# EAGLE schematic E-P-204-R3.4 (EAGLE 7.7.0)
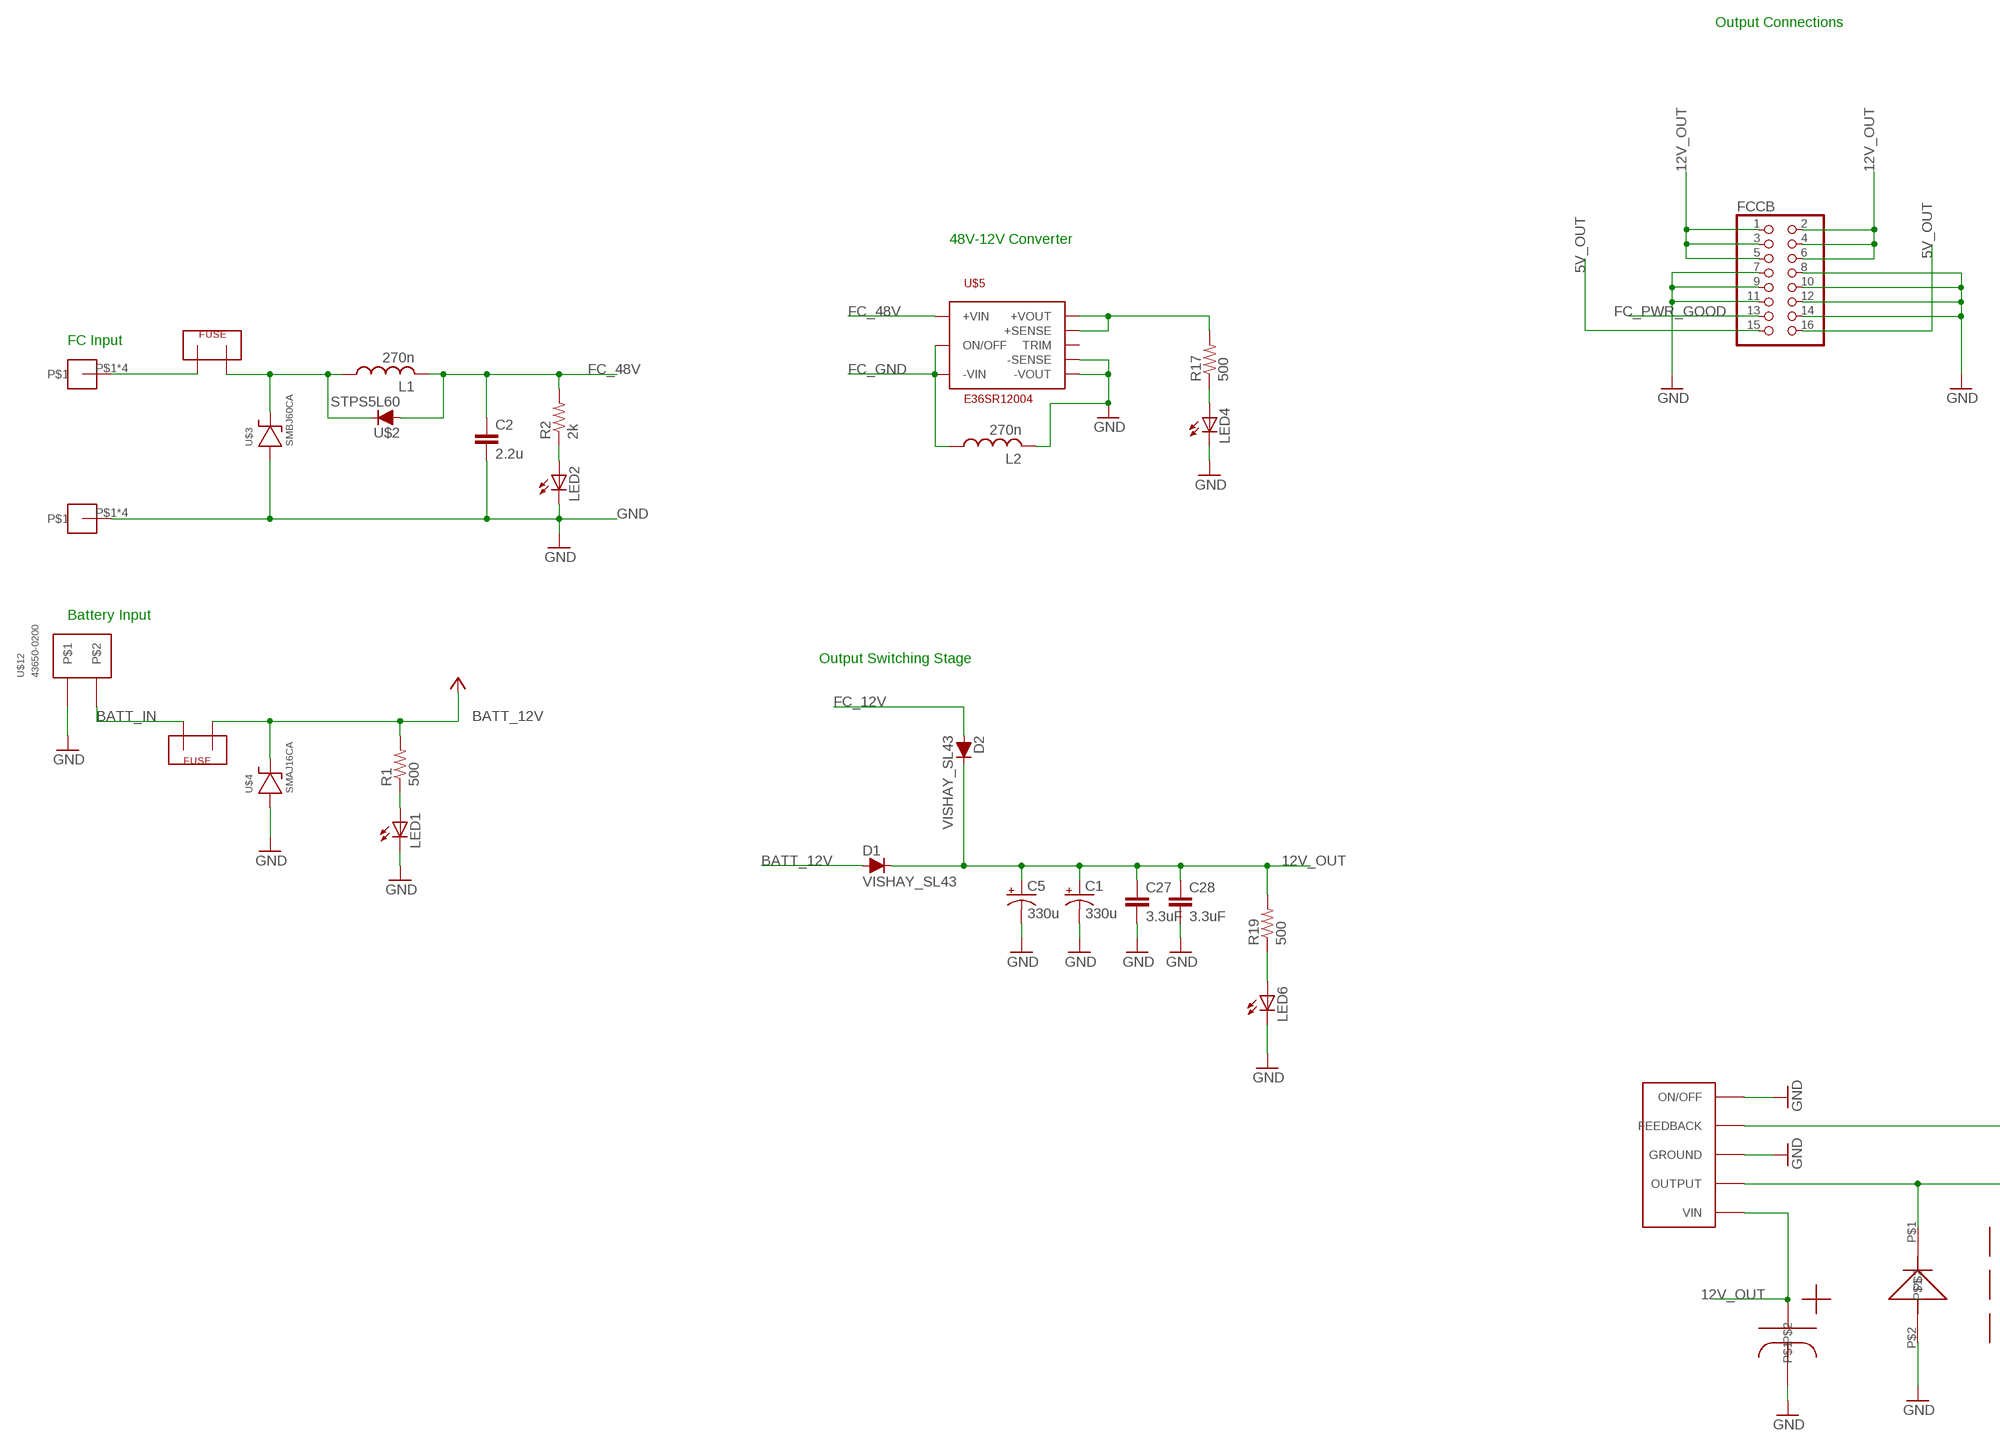
[diagram p0: schematic, sheet 1, part 1 of 2]
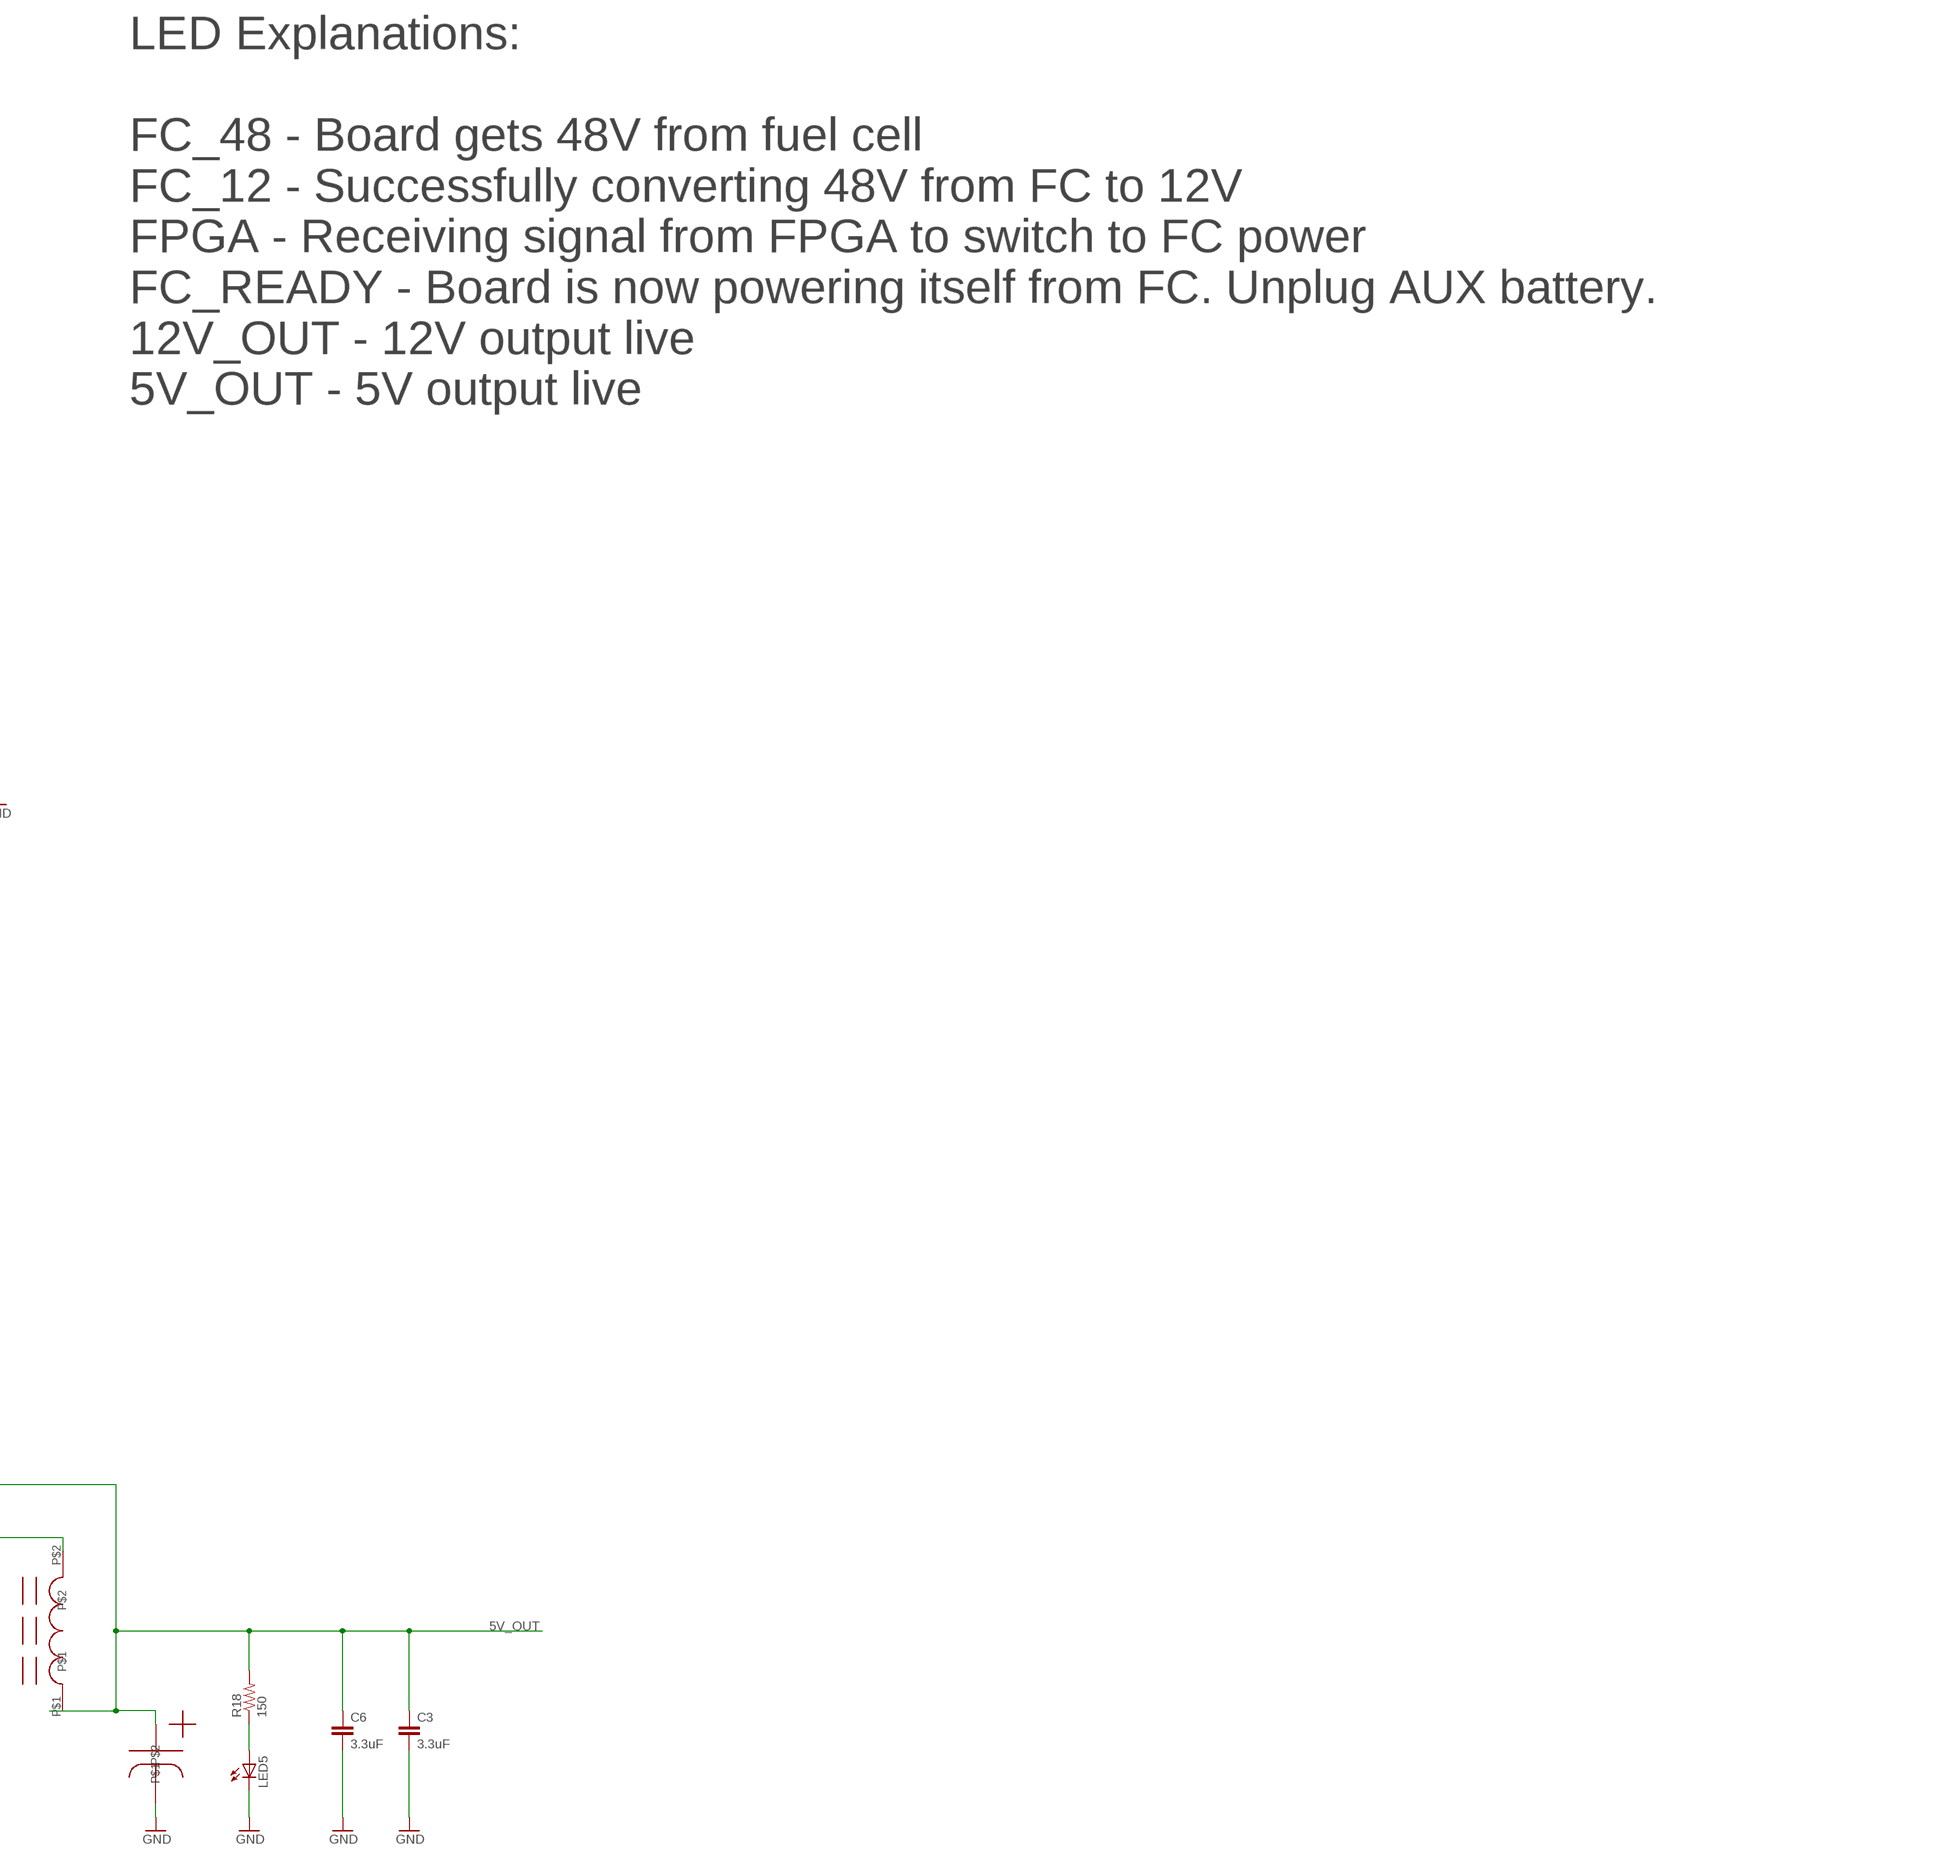
[diagram p1: schematic, sheet 1, part 2 of 2]

## Parts
C1  330u  CAP_POLE  [PANASONIC_E]
C2  2.2u  C-EUC1210  [C1210]
C3  3.3uF  C-EUC0805K  [C0805K]
C5  330u  CAP_POLE  [PANASONIC_E]
C6  3.3uF  C-EUC0805K  [C0805K]
C27  3.3uF  C-EUC0805K  [C0805K]
C28  3.3uF  C-EUC0805K  [C0805K]
D1  VISHAY_SL43  [DO-214AB_SMC]
D2  VISHAY_SL43  [DO-214AB_SMC]
FCCB  PINHD-2X8  [2X08]
L1  270n  L-USL3225P  [L3225P]
L2  270n  L-USL3225P  [L3225P]
LED1  LED1206  [LED-1206]
LED2  LED1206  [LED-1206]
LED4  LED1206  [LED-1206]
LED5  LED1206  [LED-1206]
LED6  LED1206  [LED-1206]
R1  500  R-US_M0805  [M0805]
R2  2k  R-US_M0805  [M0805]
R17  500  R-US_M0805  [M0805]
R18  150  R-US_M0805  [M0805]
R19  500  R-US_M0805  [M0805]
U$2  STPS5L60  [STM_SMC]
U$3  SMBJ60CA  [.277X.089]
U$4  SMAJ16CA  [.25X.07]
U$5  E36SR12004  [2.30X0.90X0.34]
U$6  SCREW-8191  [SCREW-8191]
U$7  FUSEMINI-BLADE  [MINI-BLADE-FUSE]
U$8  SCREW-8191  [SCREW-8191]
U$9  MBR360GOS  [MBR360GOS]
U$10  FUSEMINI-BLADE  [MINI-BLADE-FUSE]
U$12  43650-0200  [43650-0200]
U$14  LM2576  [D2PAK-5]
U$15  CAPESK107M025AC3AA  [ESK107M025AC3AA]
U$16  CAPESK108M025AH4EA  [ESK108M025AH4EA]
U$17  M1418-ND  [M1418-ND]

## Nets
5V_OUT: C3.1 C6.1 FCCB.15 FCCB.16 R18.2 U$14.4(FEEDBACK) U$16.P$1
12V_OUT: C1.+ C5.+ C27.1 C28.1 D1.C D2.C FCCB.1 FCCB.2 FCCB.3 FCCB.4 FCCB.5 FCCB.6 R19.2 U$14.1(VIN) U$15.P$1
BATT_12V: D1.A R1.2 U$4.CATHODE U$10.OUT ; supply symbol labelled +5V
BATT_IN: U$10.IN U$12.P$1
FC_12V: D2.A R17.2 U$5.P$7(+SENSE) U$5.P$8(+VOUT)
FC_48V: C2.1 L1.2 R2.2 U$2.A U$5.P$1(+VIN)
FC_FUSED: L1.1 U$2.C U$3.CATHODE U$7.IN
FC_GND: L2.1 U$5.P$2(ON/OFF) U$5.P$3(-VIN)
FC_IN: U$7.OUT U$8.P$1 U$8.P$2 U$8.P$3 U$8.P$4
FC_PWR_GOOD: FCCB.13
GND: C1.- C2.2 C3.2 C5.- C6.2 C27.2 C28.2 FCCB.7 FCCB.8 FCCB.9 FCCB.10 FCCB.11 FCCB.12 FCCB.14 L2.2 LED1.C LED2.C LED4.C LED5.C LED6.C U$3.ANODE U$4.ANODE U$5.P$4(-VOUT) U$5.P$5(-SENSE) U$6.P$1 U$6.P$2 U$6.P$3 U$6.P$4 U$9.P$2 U$12.P$2 U$14.3(GROUND) U$14.5(ON/OFF) U$14.GROUND U$15.P$2 U$16.P$2
N$3: LED1.A R1.1
N$4: LED2.A R2.1
N$16: U$9.P$1 U$14.2(OUTPUT) U$17.P$2
N$21: LED4.A R17.1
N$22: LED5.A R18.1
N$24: LED6.A R19.1
Unconnected: U$5.P$6(TRIM) U$17.P$1

## Notes on the sheet
- LED Explanations:
  
  FC_48 - Board gets 48V from fuel cell
  FC_12 - Successfully converting 48V from FC to 12V
  FPGA - Receiving signal from FPGA to switch to FC power
  FC_READY - Board is now powering itself from FC. Unplug AUX battery.
  12V_OUT - 12V output live
  5V_OUT - 5V output live
- Output Connections
- 48V-12V Converter
- FC Input
- Battery Input
- Output Switching Stage

## Library data of the parts
C1 C5 = SparkFun-Capacitors:CAP_POL: Capacitor Polarized These are standard SMD and PTH capacitors. Normally 10uF, 47uF, and 100uF in electrolytic and tantalum varieties. Always verify the external diameter of the through hole cap, it varies with capacity, voltage, and manufacturer. The EIA devices should be standard.
C2 C3 C6 C27 C28 = resistor:C-EU: CAPACITOR, European symbol
D1 D2 = Power Board Components:VISHAY_SL43
FCCB = pinhead:PINHD-2X8: PIN HEADER
L1 L2 = resistor:L-US: INDUCTOR, American symbol
LED1 LED2 LED4-LED6 = SparkFun:LED: LEDs Standard schematic elements and footprints for 5mm, 3mm, 1206, and 0603 sized LEDs. 5mm - Spark Fun Electronics SKU : COM-00529 (and others)
R1 R2 R17-R19 = rcl:R-US_: RESISTOR, American symbol
U$2 = Power Board Components:STPS5L60
U$3 = Power Board Components:SMBJ60CA
U$4 = Power Board Components:SMAJ16CA
U$5 = Power Board Components:E36SR12004
U$6 U$8 = Shell2013:SCREW-8191
U$7 U$10 = Shell2013:FUSE
U$9 = Shell2013:MBR360GOS
U$12 = Shell2013:43650-0200
U$14 = Shell2015:LM2576
U$15 U$16 = Shell2015:CAP
U$17 = Shell2015:M1418-ND: 100uF inductor